# EAGLE design fietslicht (EAGLE 5.04)
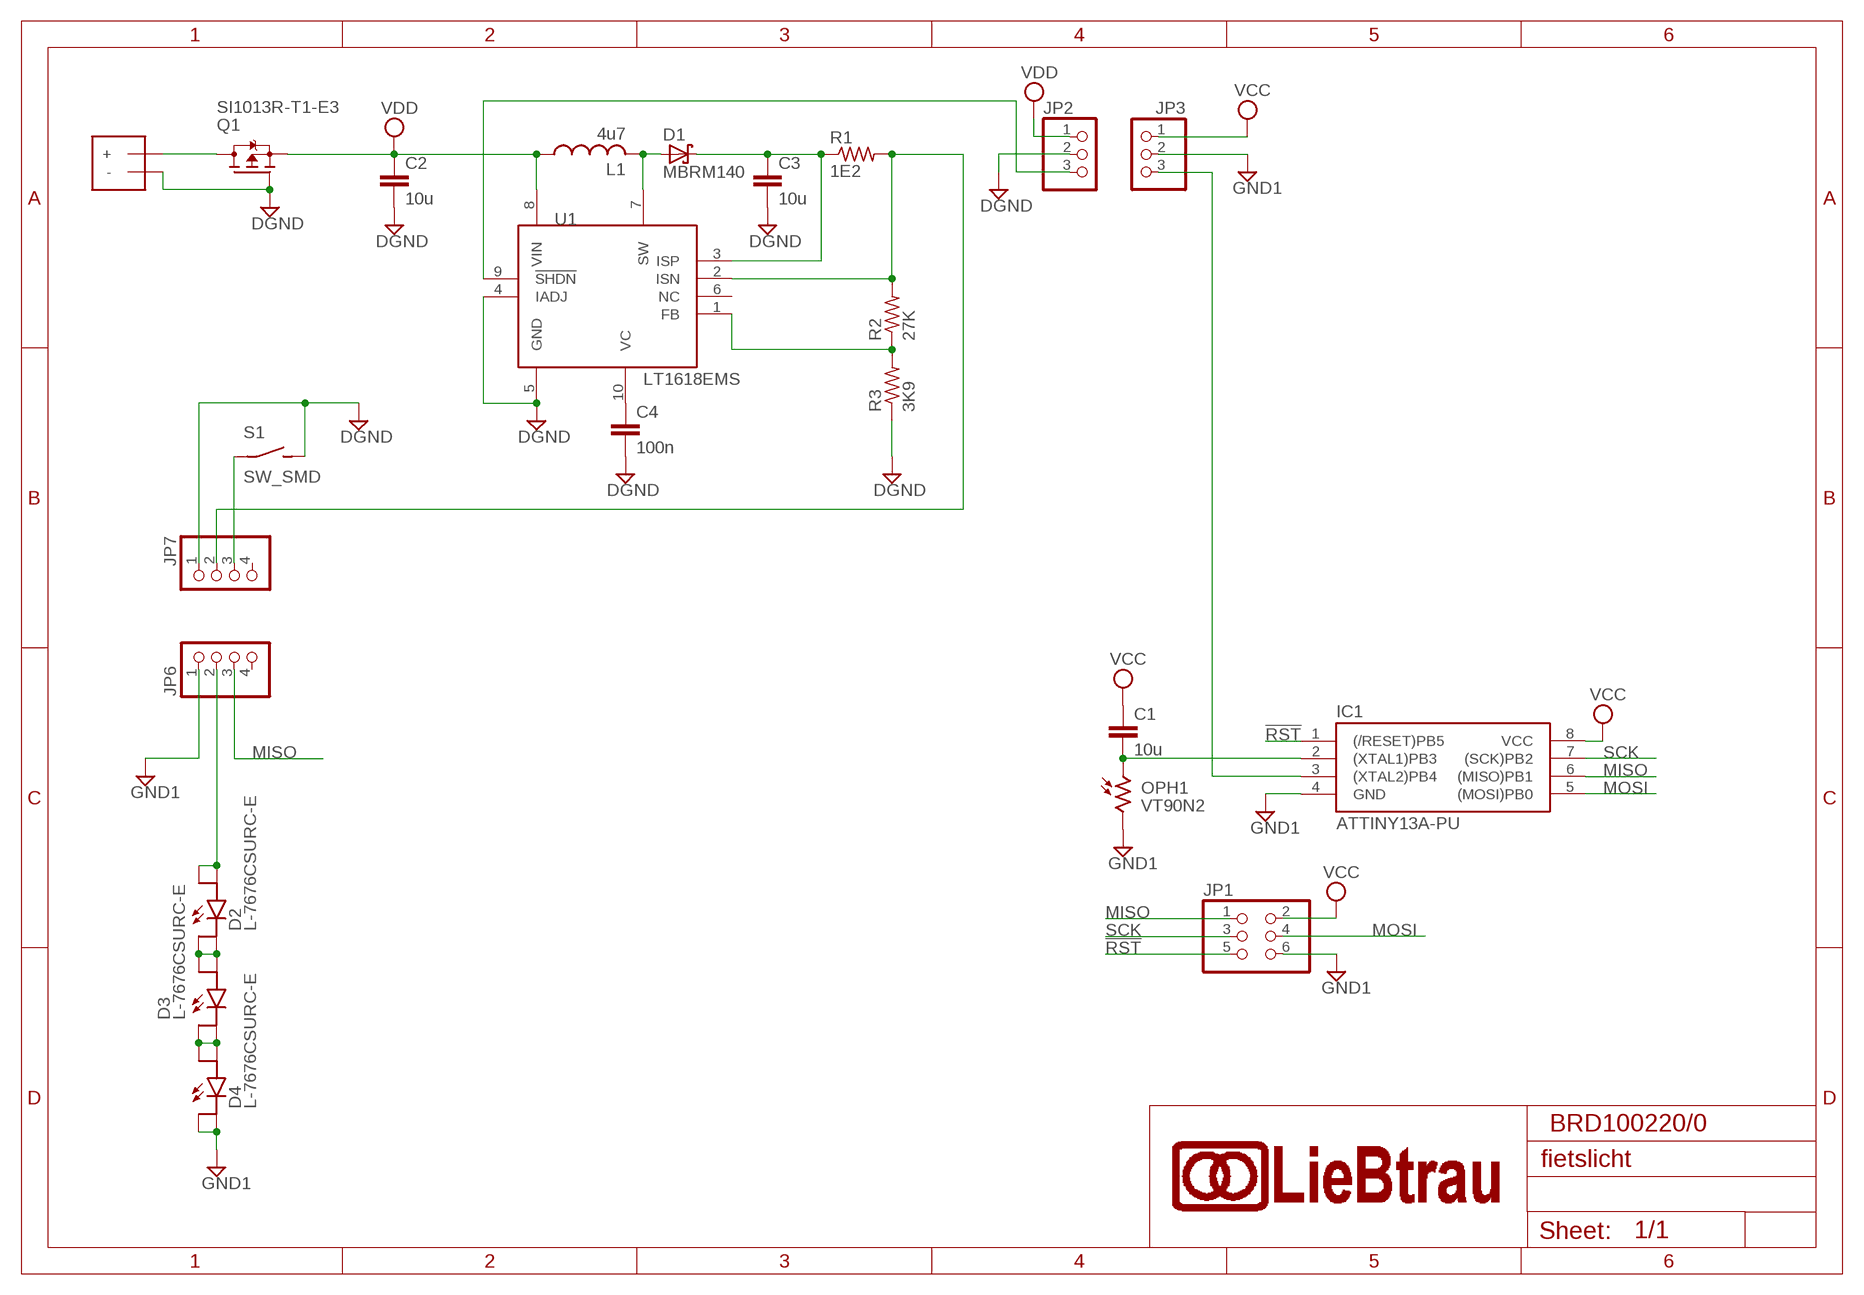
[diagram p0: schematic, sheet 1]

## Parts
C1  10u  C-EUC1206  [C1206]
C2  10u  C-EUC1206  [C1206]
C3  10u  C-EUC1206  [C1206]
C4  100n  C-EUC0805  [C0805]
D1  MBRM140  [CASE457]
D2  L-7676CSURC-E  [SUPERFLUX_LED]
D3  L-7676CSURC-E  [SUPERFLUX_LED]
D4  L-7676CSURC-E  [SUPERFLUX_LED]
IC1  ATTINY13A-PU  [DIL08]
J1  BATT  [BATT]
JP1  PINHD-2X3  [2X03]
JP2  PINHD-1X3  [1X03]
JP3  PINHD-1X3  [1X03]
JP6  PINHD-1X4  [1X04]
JP7  PINHD-1X4  [1X04]
L1  4u7  LQH6PP  [L2424]
OPH1  VT90N2  [VT900]
Q1  SI1013R-T1-E3  [EMT3]
R1  1E2  R-US_R1206  [R1206]
R2  27K  R-US_R0805  [R0805]
R3  3K9  R-US_R0805  [R0805]
S1  SW_SMD  [SW_SMD]
U1  LT1618EMS  [MSOP10]

## Nets
!RST: IC1.1((/RESET)PB5) JP1.5
DGND: C2.2 C3.2 C4.2 J1.- JP2.2 JP7.1 Q1.G R3.1 S1.P$2(S) U1.4(IADJ) U1.5(GND)
GND1: D4.1(C) D4.3(C) IC1.4(GND) JP1.6 JP3.2 JP6.1 OPH1.2
MISO: IC1.6((MISO)PB1) JP1.1 JP6.3
MOSI: IC1.5((MOSI)PB0) JP1.4
N$1: JP2.3 U1.9(!SHDN)
N$2: C1.2 IC1.2((XTAL1)PB3) OPH1.1
N$3: IC1.3((XTAL2)PB4) JP3.3
N$4: C3.1 D1.C R1.1 U1.3(ISP)
N$5: D1.A L1.2 U1.7(SW)
N$6: JP7.2 R1.2 R2.2 U1.2(ISN)
N$7: C4.1 U1.10(VC)
N$8: R2.1 R3.2 U1.1(FB)
N$9: D2.1(C) D2.3(C) D3.2(A) D3.4(A)
N$11: D3.1(C) D3.3(C) D4.2(A) D4.4(A)
N$13: J1.+ Q1.D
N$15: JP7.3 S1.P$1(P)
N$16: D2.2(A) D2.4(A) JP6.2
SCK: IC1.7((SCK)PB2) JP1.3
VCC: C1.1 IC1.8(VCC) JP1.2 JP3.1
VDD: C2.1 JP2.1 L1.1 Q1.S U1.8(VIN)
Unconnected: JP6.4 JP7.4 U1.6(NC)

## Notes on the sheet
- BRD100220/0

## Library data of the parts
C1-C4 = rcl:C-EU: CAPACITOR, European symbol
D1 = fietslicht:MBRM140
D2-D4 = fietslicht:L-7676CSURC-E
IC1 = fietslicht:ATTINY13A: MICROCONTROLLER 1 Kbytes FLASH
J1 = fietslicht:BATT
JP1 = rfid:PINHD-2X3: PIN HEADER
JP2 JP3 = pinhead:PINHD-1X3: PIN HEADER
JP6 JP7 = pinhead:PINHD-1X4: PIN HEADER
L1 = fietslicht:LQH6PP
OPH1 = photo-elements:VT9: Photoconductive Cell VT900 Series Source: http://optoelectronics.perkinelmer.com/content/Datasheets/DTS_vt900seriesdatasheet.pdf
Q1 = fietslicht:SI1013R
R1-R3 = rcl:R-US_: RESISTOR, American symbol
S1 = fietslicht:SW_SMD
U1 = fietslicht:LT1618EMS

## Board
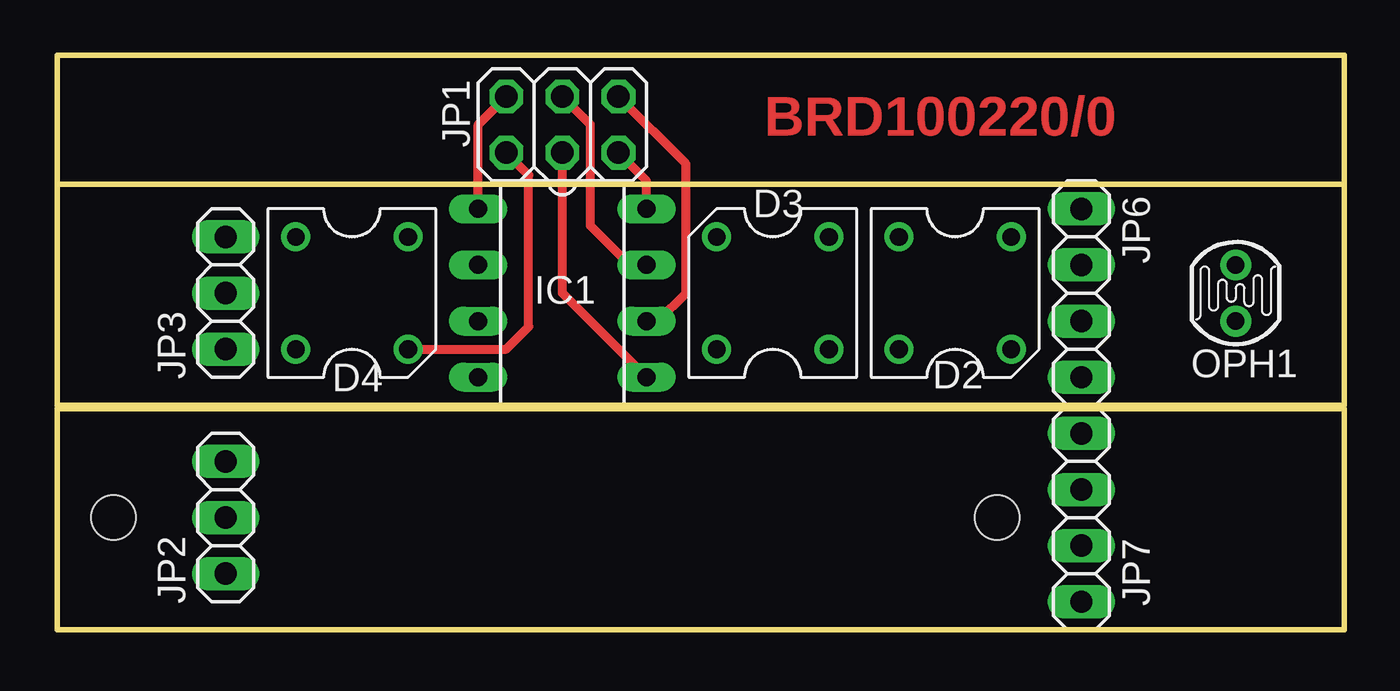
[diagram p1: board, top side]
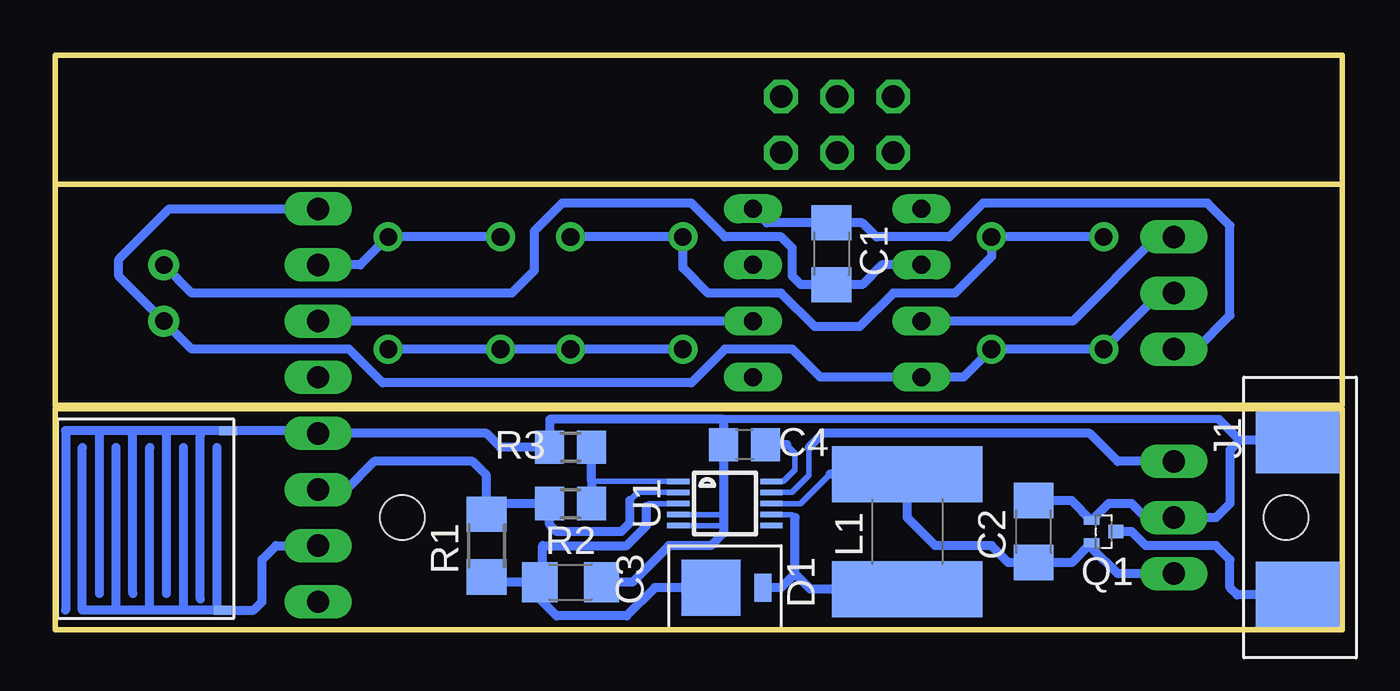
[diagram p2: board, bottom side, seen from below]

Size 58.26 x 26 mm. Coordinates in mm from the lower left corner, seen from the top.
Outline: 58.26,20 58.26,10.16 0,10.16 0,20
Outline: 58.26,20 58.26,20.16 0,20.16 0,20
Outline: 0,20 0,26 58.26,26 58.26,20
Outline: 0,0 58.26,0 58.26,10 0,10 0,0
Copper layers (1*16): Top 0.035mm / dielectric 1.5mm / Bottom 0.035mm
Design rules "default": minimum track width 10mil, minimum drill 24mil, track to track 8mil, track to pad 8mil, pad to pad 8mil, via to via 8mil, smd to smd 8mil, copper to edge 40mil, drill to drill 8mil, minimum pad ring 10mil, minimum via ring 8mil, stop-mask expansion 4mil, vias tented up to drill 0mil, thermal gap 10mil
Holes 2 mm at 2.54,5.08 42.55,5.08

### Footprints (pad centres in the part's own frame; a part is rotated, then mirrored left to right if it is on the bottom)
C1206 = smd 1.6 x 1.8: 1 -1.4,0; 2 1.4,0
C0805 = smd 1.3 x 1.5: 1 -0.95,0; 2 0.95,0
CASE457 = smd 0.762 x 1.27: A 2.35,0 | smd 2.67 x 2.54: C 0,0
SUPERFLUX_LED = drill 0.8 round: 1 2.54,-2.54; 2 -2.54,-2.54; 3 2.54,2.54; 4 -2.54,2.54
DIL08 = drill 0.813 long: 1 -3.81,-3.81; 2 -1.27,-3.81; 3 1.27,-3.81; 4 3.81,-3.81; 5 3.81,3.81; 6 1.27,3.81; 7 -1.27,3.81; 8 -3.81,3.81
BATT = smd 4 x 3: + 0,3.5; - 0,-3.5
2X03 = drill 1.016 octagon: 1 -2.54,-1.27; 2 -2.54,1.27; 3 0,-1.27; 4 0,1.27; 5 2.54,-1.27; 6 2.54,1.27
1X03 = drill 1.016 long: 1 -2.54,0; 2 0,0; 3 2.54,0
1X04 = drill 1.016 long: 1 -3.81,0; 2 -1.27,0; 3 1.27,0; 4 3.81,0
L2424 = smd 2.53 x 6.8: 1 -2.6,0; 2 2.6,0
VT900 = drill 0.8 pad 1.4 round: 1 -1.27,0; 2 1.27,0
EMT3 = smd 0.6 x 0.7: D 0,0.55 | smd 0.4 x 0.7: G -0.5,-0.55; S 0.5,-0.55
R1206 = smd 1.6 x 1.803: 1 -1.422,0; 2 1.422,0
R0805 = smd 1.3 x 1.5: 1 -0.95,0; 2 0.95,0
SW_SMD = smd 0.813 x 0.406: P$1 -3.302,3.556; P$2 -3.556,-4.572
MSOP10 = smd 0.25 x 1: 1 -1,-2.113; 2 -0.5,-2.113; 3 0,-2.113; 4 0.5,-2.113; 5 1,-2.113; 6 1,2.113; 7 0.5,2.113; 8 0,2.113; 9 -0.5,2.113; 10 -1,2.113

### Placement (x,y rotation side)
C1  23.11,17.02 270 bottom
C2  13.97,4.45 90 bottom
C3  34.92,2.16 0 bottom
C4  27.05,8.38 180 bottom
D1  28.57,1.91 0 bottom
D2  40.64,15.24 270 top
D3  32.38,15.24 90 top
D4  13.34,15.24 270 top
IC1  22.86,15.24 270 top
J1  1.91,5.08 180 bottom
JP1  22.86,22.86 180 top
JP2  7.62,5.08 90 top
JP3  7.62,15.24 90 top
JP6  46.35,15.24 270 top
JP7  46.35,5.08 270 top
L1  19.68,4.45 270 bottom
OPH1  53.34,15.24 270 top
Q1  10.79,4.45 270 bottom
R1  38.73,3.81 90 bottom
R2  34.92,5.71 180 bottom
R3  34.92,8.26 0 bottom
S1  53.98,4.45 180 bottom
U1  27.94,5.71 270 bottom
U$1  [DINA5_L]  -68.83,-75.26 0 top  (outside the outline)

### Tracks (layer width: path | path; a pad name or v marks a point on that pad's centre or on a via)
!RST
  Top 0.406: JP1.5 19.05,22.86 IC1.1
DGND
  Bottom 0.254: 28,4.38 28,4.45 28,4.71 U1.5 | U1.4 28.14,5.21 arc90 28,5.08
  Bottom 0.356: 5.57,9.53 28,9.53
  Bottom 0.406: J1.- 4.63,8.58 | 4.63,8.58 5.08,8.13 5.08,5.71 5.71,5.08 JP2.2 8.89,5.08 9.53,5.71 10.57,5.71 Q1.G 12.24,5.84 C2.2 | 4.63,8.58 5.57,9.53 | C3.2 32.13,2.16 30.48,3.81 28.57,3.81 28,4.38 | 28,4.45 28,5.08 C4.2 28,9.53 35.88,9.53 R3.1 38.1,8.26 38.73,8.89 JP7.1 46.48,9.02 S1.P$2
GND1
  Top 0.406: D4.3 20.32,12.7 21.34,13.72 21.34,20.57 JP1.6
  Bottom 0.406: JP3.2 8.26,15.24 D4.1 D4.3 17.14,11.43 IC1.4 23.62,11.43 24.89,12.7 27.94,12.7 29.46,11.18 43.43,11.18 44.96,12.7 52.07,12.7 OPH1.2 55.37,16 55.37,16.76 53.09,19.05 JP6.1
MISO
  Top 0.406: JP1.1 28.45,21.08 28.45,15.24 27.18,13.97 IC1.6
  Bottom 0.406: IC1.6 JP6.3
MOSI
  Top 0.406: JP1.4 22.86,15.24 IC1.5
N$1
  Bottom 0.254: U1.9 24.9,6.21 24.13,6.99 24.13,8.26
  Bottom 0.406: 24.13,8.26 23.5,8.89 11.43,8.89 10.16,7.62 JP2.3
N$2
  Bottom 0.406: OPH1.1 52.07,15.24 37.59,15.24 36.58,16.26 36.58,18.03 35.31,19.3 29.46,19.3 27.94,17.78 25.4,17.78 24.89,17.27 24.89,16 24.51,15.62 C1.2 21.72,15.62 20.83,16.51 IC1.2
N$3
  Bottom 0.406: IC1.3 12.19,13.97 8.38,17.78 JP3.3
N$4
  Bottom 0.254: U1.3 31.37,5.71 31.5,5.59 | C3.1 36.2,2.67
  Bottom 0.406: 31.5,5.59 31.5,4.7 32.38,3.81 36.2,3.81 36.2,2.67 | D1.C 31.11,1.91 32.38,0.64 35.56,0.64 36.33,1.4 C3.1 38.73,2.16 R1.1
N$5
  Bottom 0.254: U1.7 24.9,5.21 24.77,5.08
  Bottom 0.406: 24.77,2.54 24.77,5.08 | 24.77,2.54 25.4,1.91 D1.A | L1.2 24.07,1.84 24.77,2.54
N$6
  Bottom 0.254: U1.2 31.89,6.21 32.26,5.84
  Bottom 0.406: 32.26,5.84 32.26,4.83 32.64,4.45 35.56,4.45 35.88,4.76 R2.2 38.25,5.71 arc-90 R1.2 38.73,6.99 39.37,7.62 43.81,7.62 45.09,6.35 JP7.2
N$7
  Bottom 0.254: U1.10 25.29,6.71 24.77,7.24 24.77,8 25.15,8.38
  Bottom 0.406: 25.15,8.38 C4.1
N$8
  Bottom 0.254: U1.1 33.98,6.71
  Bottom 0.406: R2.1 33.98,6.71 R3.2
N$9
  Bottom 0.406: D2.3 D2.1 D3.2 D3.4
N$11
  Bottom 0.406: D4.2 D4.4 15.88,16.89 17.53,15.24 20.32,15.24 21.84,13.72 23.88,13.72 25.4,15.24 28.7,15.24 29.84,16.38 D3.3 D3.1
N$13
  Bottom 0.406: J1.+ 4.75,1.58 5.08,1.91 5.08,3.17 5.71,3.81 8.89,3.81 9.53,4.45 Q1.D
N$15
  Bottom 0.406: S1.P$1 49.28,0.89 48.9,1.27 48.9,3.17 48.26,3.81 JP7.3
N$16
  Bottom 0.406: JP6.2 44.45,16.51 D2.4 D2.2
SCK
  Top 0.406: JP1.3 24.13,22.86 24.13,18.29 25.91,16.51 IC1.7
VCC
  Top 0.406: JP1.2 26.67,20.32 IC1.8
  Bottom 0.406: IC1.8 26.04,18.42 C1.1 21.72,18.42 21.08,17.78 17.78,17.78 16.26,19.3 6.1,19.3 5.08,18.29 5.08,14.22 6.6,12.7 JP3.1
VDD
  Bottom 0.254: U1.8 24.51,5.71 23.18,7.04
  Bottom 0.406: JP2.1 10.16,2.54 11.35,3.73 Q1.S 12.24,3.04 C2.1 15.11,3.04 15.88,3.81 18.41,3.81 19.68,5.08 L1.1 23.18,7.04

### Text on the board
Top: BRD100220/0
tDocu: BRD100220/0 | 0
bDocu: BRD100220/0 | 0